# Altium schematic sheet Buzzer_LED.SchDoc
size A3; SheetNumber: 6; SheetTotal: 6
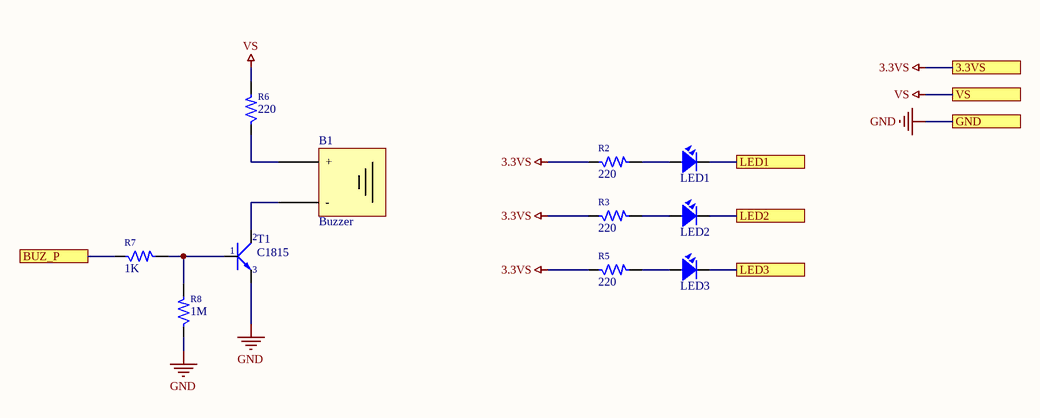
[diagram p0: Buzzer_LED.SchDoc]

## Parts
B1  Buzzer  [Buzzer]
LED1  LED SMD  [SM-LED-0805-Blue]  (value not drawn)
LED2  LED SMD  [SM-LED-0805-Blue]  (value not drawn)
LED3  LED SMD  [SM-LED-0805-Blue]  (value not drawn)
R2  220  [RESC2012X70N]
R3  220  [RESC2012X70N]
R5  220  [RESC2012X70N]
R6  220  [RESC2012X70N]
R7  1K  [RESC2012X70N]
R8  1M  [RESC2012X70N]
T1  C1815  [SOT23-3]

## Ports
3.3VS, BUZ_P, GND, LED1, LED2, LED3, VS

## Nets
3.3VS: R2.1 R3.1 R5.1 ; port 3.3VS
GND: R8.1 T1.2(E) ; port GND
VS: R6.2 ; port VS
BUZ_P: R7.1 ; port BUZ_P
LED1: LED1.2 ; port LED1
LED2: LED2.2 ; port LED2
LED3: LED3.2 ; port LED3
NetB1_+: B1.+ R6.1
NetB1_-: B1.- T1.3(C)
NetLED1_1: LED1.1 R2.2
NetLED2_1: LED2.1 R3.2
NetLED3_1: LED3.1 R5.2
NetR7_2: R7.2 R8.2 T1.1(B)

## Library data of the parts
B1 = Buzzer: 12xx
LED1-LED3 = LED-SMD-0805
R2 R3 R5-R8 = Res SMD: Res 0805
T1 = NPN SM